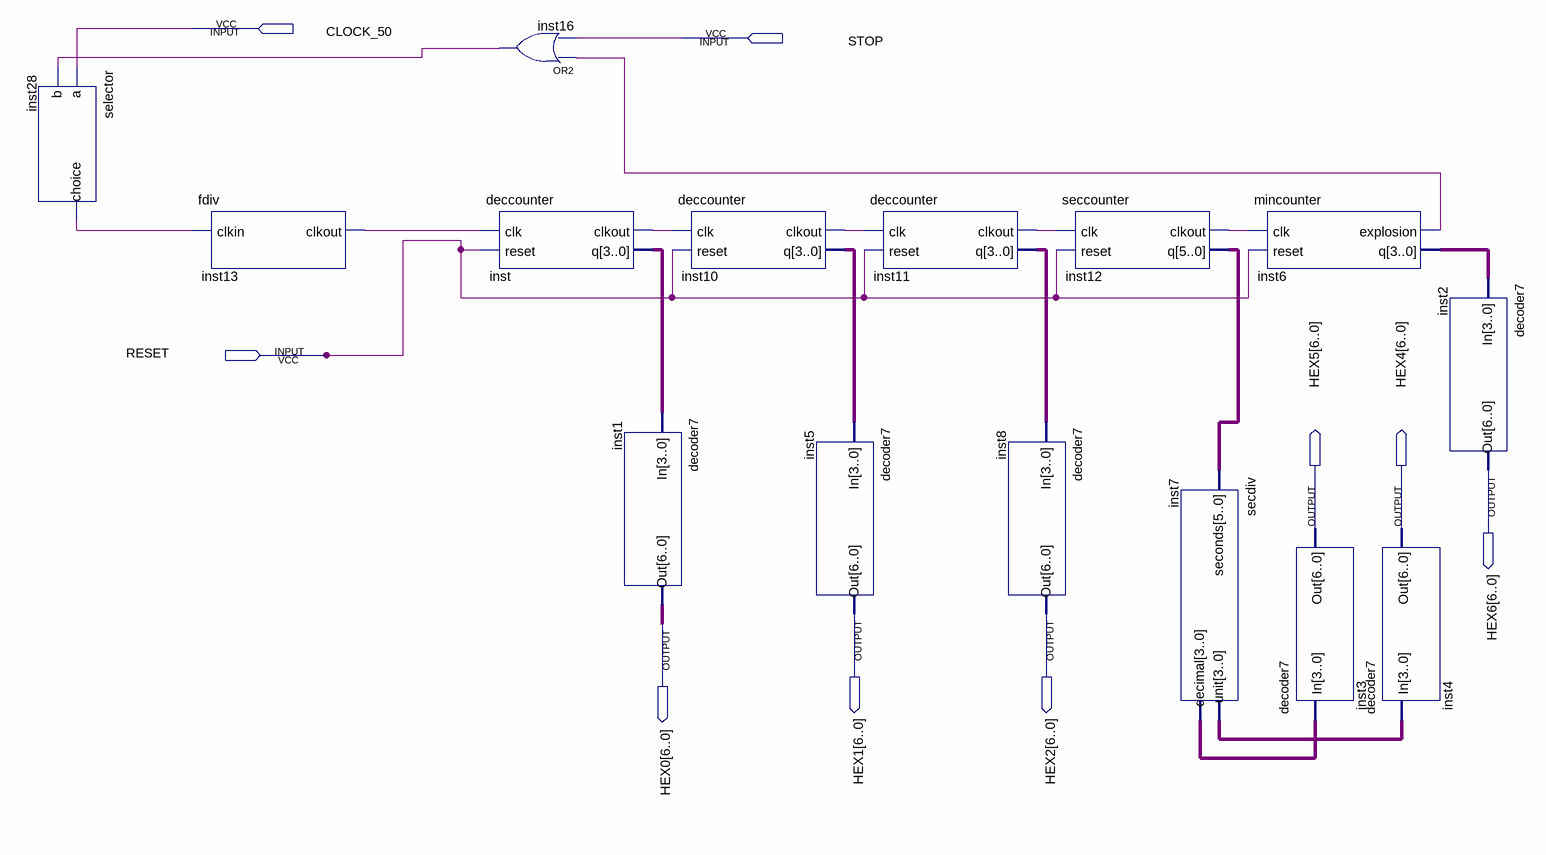
[diagram p0: schematic sheet]
// Quartus schematic timer.bdf as structural Verilog: 15 symbols, 9 pins
module timer (
  input  CLOCK_50,
  input  STOP,
  input  RESET,
  output [6:0] HEX6,
  output [6:0] HEX5,
  output [6:0] HEX4,
  output [6:0] HEX1,
  output [6:0] HEX2,
  output [6:0] HEX0
);

  wire inst6_explosion, inst10_clkout, inst11_clkout, inst12_clkout, inst13_clkout, inst16_out,
       inst28_choice, inst_clkout;
  wire [3:0] inst6_q, inst7_decimal, inst7_unit, inst10_q, inst11_q, inst_q;
  wire [5:0] inst12_q;

  selector inst28 (.a(CLOCK_50), .b(inst16_out), .choice(inst28_choice));
  fdiv inst13 (.clkin(inst28_choice), .clkout(inst13_clkout));
  or inst16 (inst16_out, inst6_explosion, STOP);
  deccounter inst (.clk(inst13_clkout), .reset(RESET), .clkout(inst_clkout), .q(inst_q));
  decoder7 inst1 (.In(inst_q), .Out(HEX0));
  deccounter inst10 (.clk(inst_clkout), .reset(RESET), .clkout(inst10_clkout), .q(inst10_q));
  decoder7 inst5 (.In(inst10_q), .Out(HEX1));
  deccounter inst11 (.clk(inst10_clkout), .reset(RESET), .clkout(inst11_clkout), .q(inst11_q));
  decoder7 inst8 (.In(inst11_q), .Out(HEX2));
  seccounter inst12 (.clk(inst11_clkout), .reset(RESET), .clkout(inst12_clkout), .q(inst12_q));
  secdiv inst7 (.seconds(inst12_q), .unit(inst7_unit), .decimal(inst7_decimal));
  mincounter inst6 (.clk(inst12_clkout), .reset(RESET), .explosion(inst6_explosion), .q(inst6_q));
  decoder7 inst3 (.In(inst7_decimal), .Out(HEX5));
  decoder7 inst4 (.In(inst7_unit), .Out(HEX4));
  decoder7 inst2 (.In(inst6_q), .Out(HEX6));
endmodule
